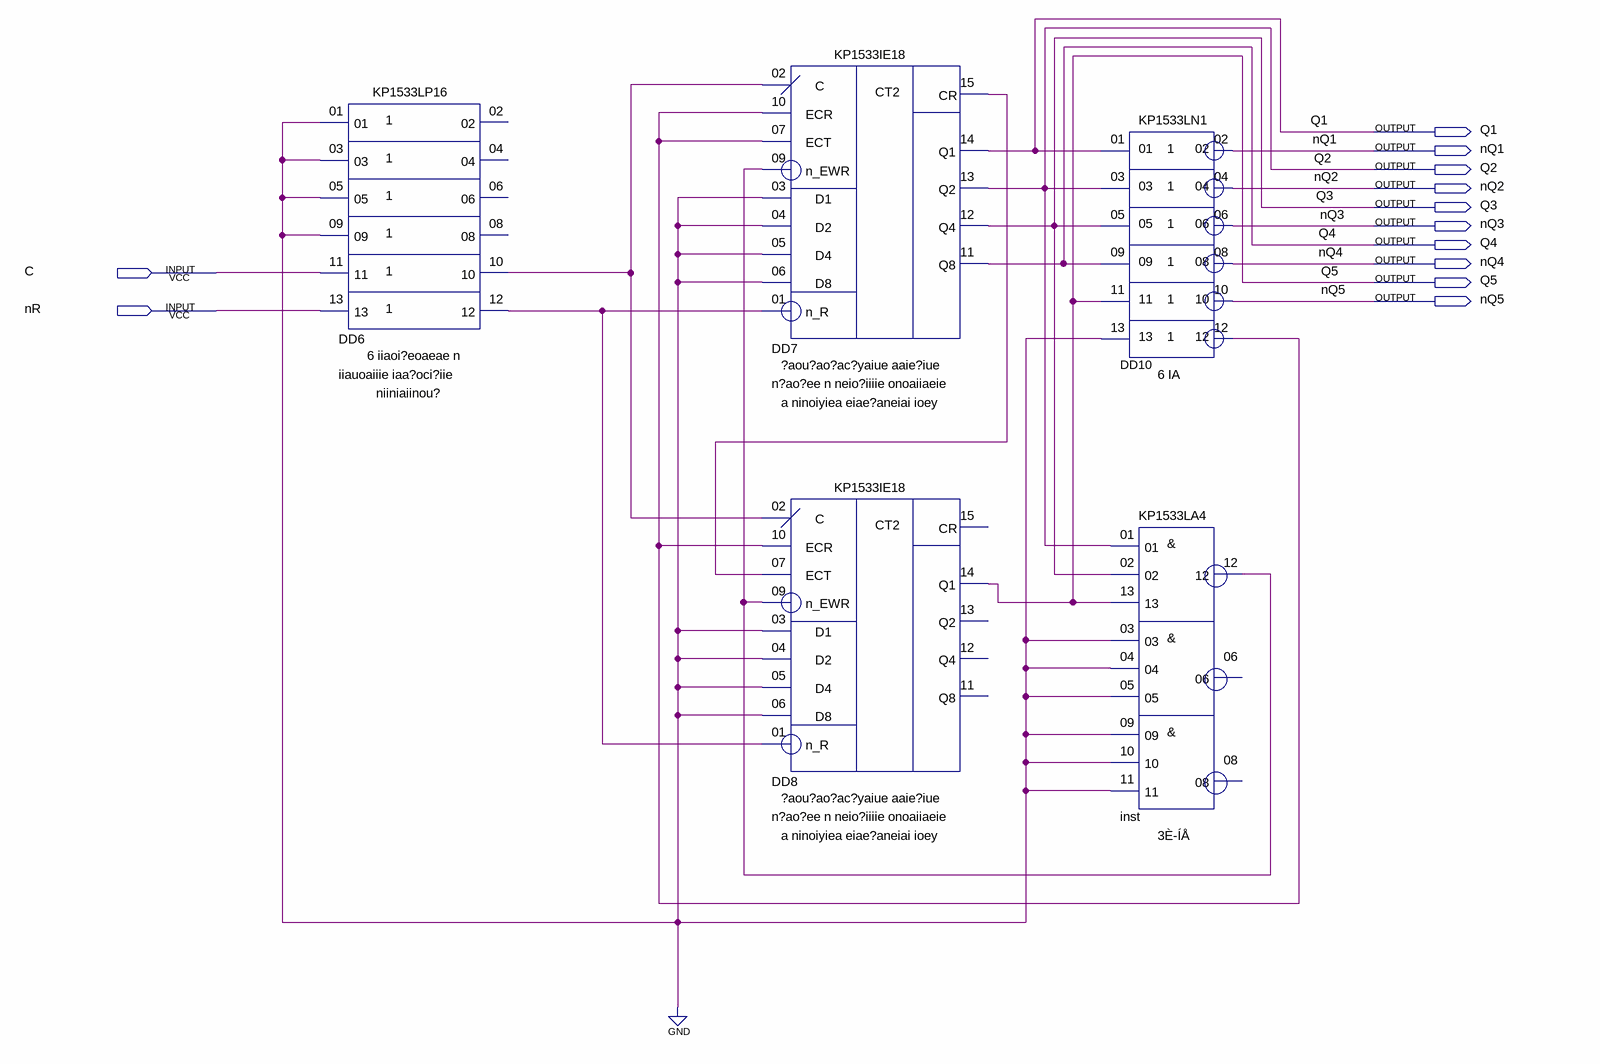
[diagram p0: schematic sheet]
// Quartus schematic _BinaryCounterIE18.bdf as structural Verilog: 5 symbols, 12 pins
module _BinaryCounterIE18 (
  input  C,
  input  nR,
  output Q1,
  output nQ1,
  output Q2,
  output nQ2,
  output Q3,
  output nQ3,
  output Q4,
  output nQ4,
  output Q5,
  output nQ5
);

  wire DD6_10, DD6_12, DD7_cr, DD10_12, inst_12;

  KP1533LP16 DD6 (
    .\01 (1'b0), .\03 (1'b0), .\05 (1'b0), .\09 (1'b0), .\11 (C), .\13 (nR), .\10 (DD6_10), .\12 (DD6_12));  // open: 02, 04, 06, 08
  KP1533IE18 DD7 (
    .n_EWR(inst_12), .D1(1'b0), .D2(1'b0), .D4(1'b0), .D8(1'b0), .ECT(DD10_12), .ECR(DD10_12), .n_R(DD6_12),
    .C(DD6_10), .Q1(Q1), .Q2(Q2), .Q4(Q3), .Q8(Q4), .CR(DD7_cr));
  KP1533IE18 DD8 (
    .n_EWR(inst_12), .D1(1'b0), .D2(1'b0), .D4(1'b0), .D8(1'b0), .ECT(DD7_cr), .ECR(DD10_12), .n_R(DD6_12),
    .C(DD6_10), .Q1(Q5));  // open: Q2, Q4, Q8, CR
  KP1533LN1 DD10 (
    .\01 (Q1), .\03 (Q2), .\05 (Q3), .\09 (Q4), .\11 (Q5), .\13 (1'b0), .\02 (nQ1), .\04 (nQ2), .\06 (nQ3),
    .\08 (nQ4), .\10 (nQ5), .\12 (DD10_12));
  KP1533LA4 inst (
    .\01 (Q2), .\02 (Q3), .\13 (Q5), .\03 (1'b0), .\04 (1'b0), .\05 (1'b0), .\09 (1'b0), .\10 (1'b0),
    .\11 (1'b0), .\12 (inst_12));  // open: 06, 08
endmodule
